# EAGLE schematic GBA_Modular_Matrix (EAGLE 6.6.0)
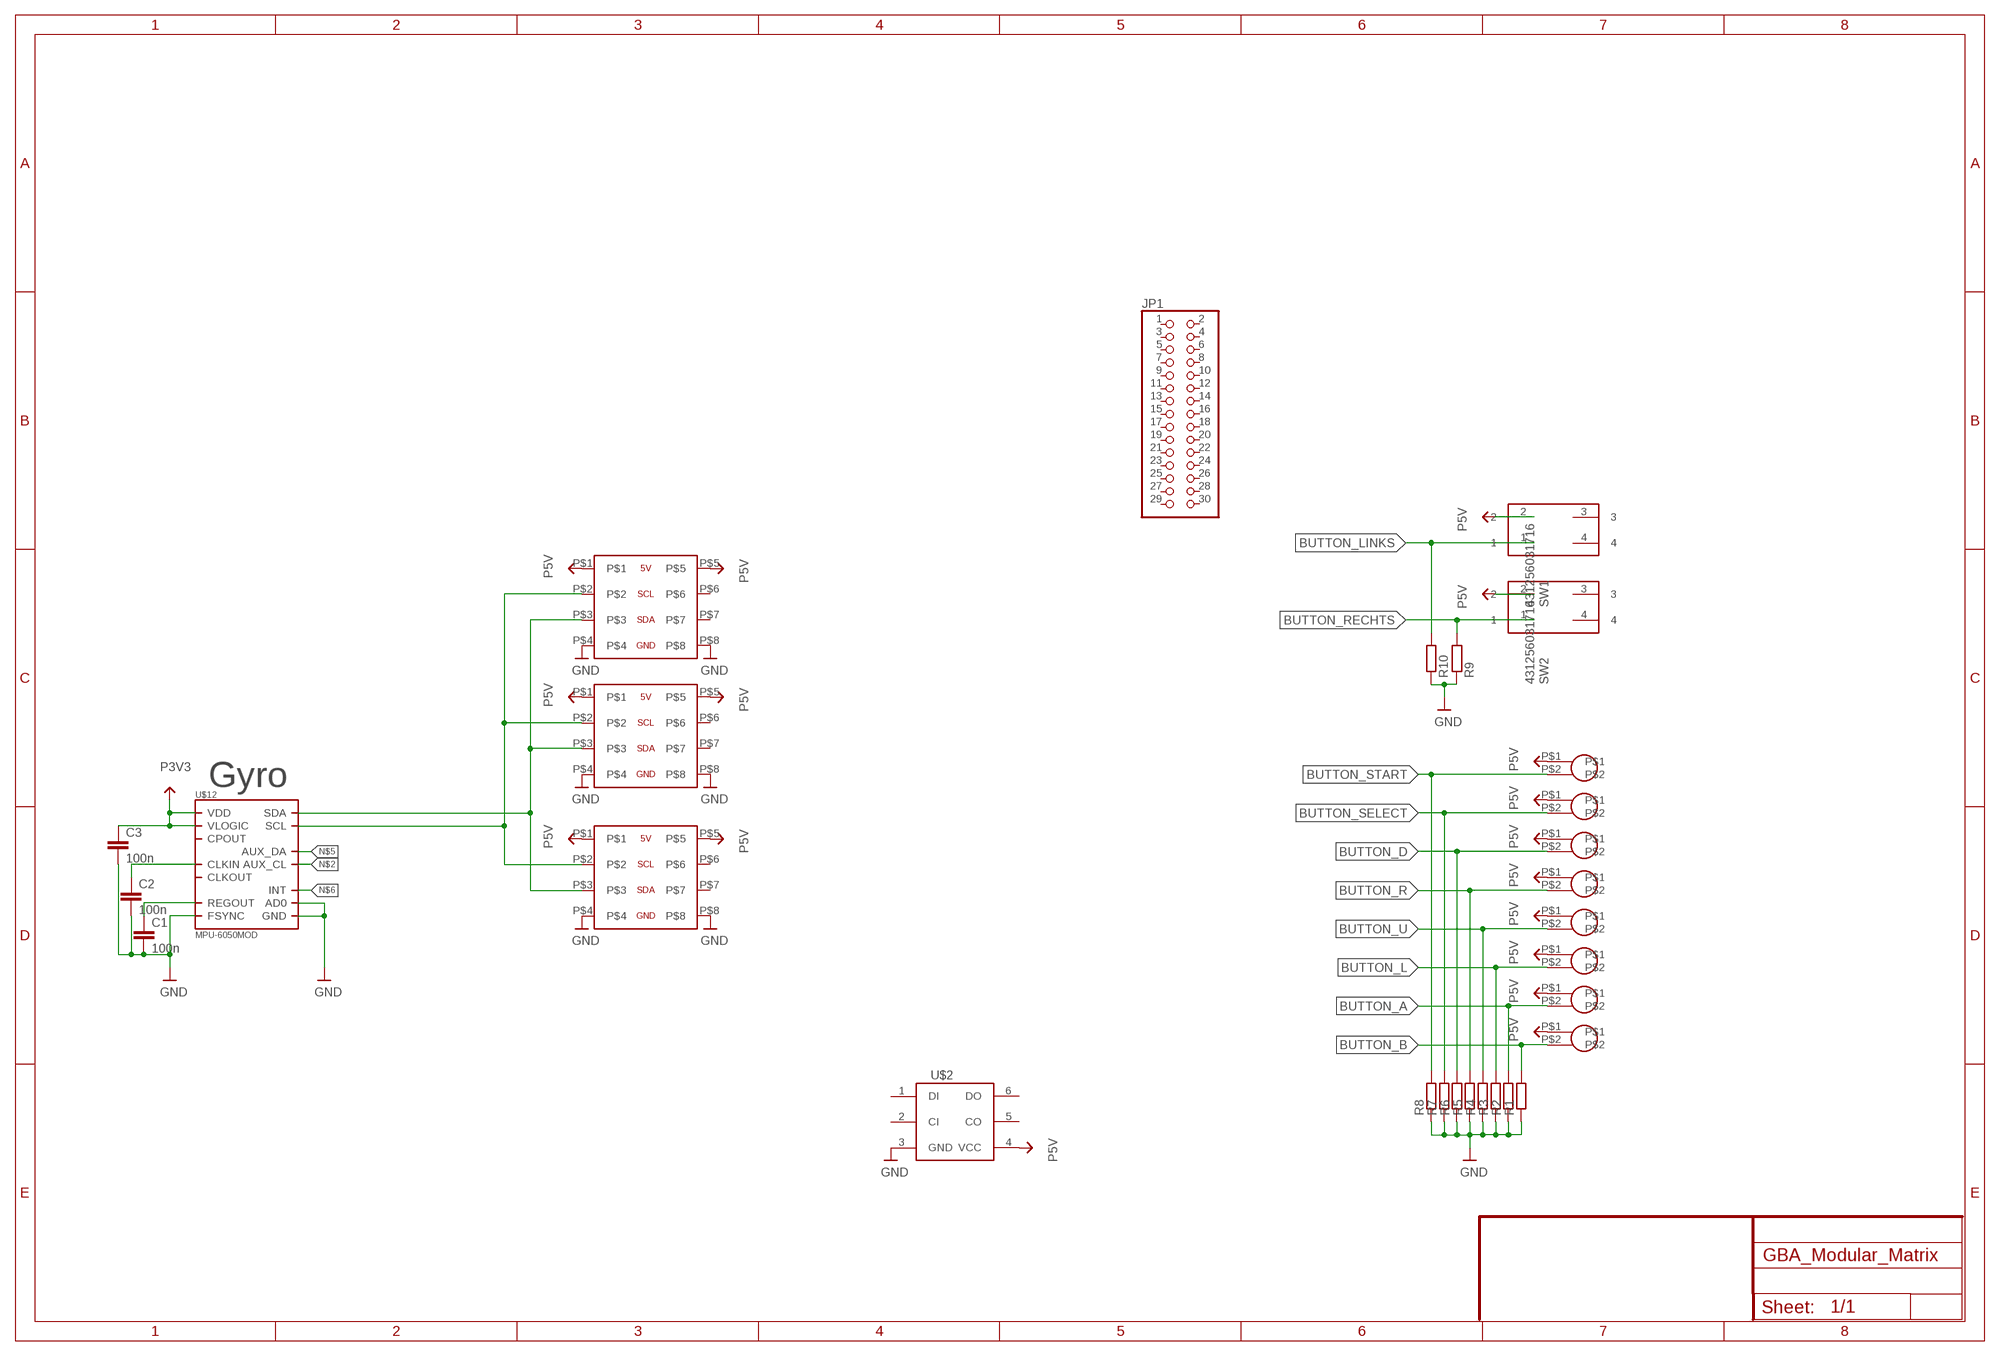
[diagram p0: schematic, sheet 1]

## Parts
C1  100n  C-EUC0603  [C0603]
C2  100n  C-EUC0603  [C0603]
C3  100n  C-EUC0603  [C0603]
JP1  PINHD-2X15  [2X15]
R1  R-EU_R0805  [R0805]
R2  R-EU_R0805  [R0805]
R3  R-EU_R0805  [R0805]
R4  R-EU_R0805  [R0805]
R5  R-EU_R0805  [R0805]
R6  R-EU_R0805  [R0805]
R7  R-EU_R0805  [R0805]
R8  R-EU_R0805  [R0805]
R9  R-EU_R0805  [R0805]
R10  R-EU_R0805  [R0805]
SW1  431256031716  [431256031716]
SW2  431256031716  [431256031716]
U$2  APA102  [LED5050]
U$4  GBA_BUTTONAB  [GBA_AB]
U$5  GBA_BUTTONAB  [GBA_AB]
U$6  GBA_BUTTONDIREKTION  [GBA_DIREKTION]
U$7  GBA_BUTTONDIREKTION  [GBA_DIREKTION]
U$8  GBA_BUTTONDIREKTION  [GBA_DIREKTION]
U$9  GBA_BUTTONDIREKTION  [GBA_DIREKTION]
U$10  GBA_BUTTONSTART  [GBA_START]
U$11  GBA_BUTTONSTART  [GBA_START]
U$12  MPU-6050MOD  [QFN.24.4X4.MOD]
U$18  DEBAUER_18X6MATRIX  [DEBAUER_16X8MATRIX]
U$19  DEBAUER_18X6MATRIX  [DEBAUER_16X8MATRIX]
U$20  DEBAUER_18X6MATRIX  [DEBAUER_16X8MATRIX]

## Nets
BUTTON_A: R2.2 U$4.P$2
BUTTON_B: R1.2 U$5.P$2
BUTTON_D: R6.2 U$6.P$2
BUTTON_L: R3.2 U$9.P$2
BUTTON_LINKS: R10.2 SW1.1
BUTTON_R: R5.2 U$7.P$2
BUTTON_RECHTS: R9.2 SW2.1
BUTTON_SELECT: R7.2 U$11.P$2
BUTTON_START: R8.2 U$10.P$2
BUTTON_U: R4.2 U$8.P$2
GND: C1.2 C2.2 C3.2 R1.1 R2.1 R3.1 R4.1 R5.1 R6.1 R7.1 R8.1 R9.1 R10.1 U$2.3(GND) U$12.9(AD0) U$12.11(FSYNC) U$12.18(GND) U$18.P$4 U$18.P$8 U$19.P$4 U$19.P$8 U$20.P$4 U$20.P$8
N$1: C2.1 U$12.1(CLKIN)
N$2: U$12.7(AUX_CL)
N$3: C1.1 U$12.10(REGOUT)
N$4: U$12.23(SCL) U$18.P$2 U$19.P$2 U$20.P$2
N$5: U$12.6(AUX_DA)
N$6: U$12.12(INT)
N$7: U$12.24(SDA) U$18.P$3 U$19.P$3 U$20.P$3
P3V3: C3.1 U$12.8(VLOGIC) U$12.13(VDD)
P5V: SW1.2 SW2.2 U$2.4(VCC) U$4.P$1 U$5.P$1 U$6.P$1 U$7.P$1 U$8.P$1 U$9.P$1 U$10.P$1 U$11.P$1 U$18.P$1 U$18.P$5 U$19.P$1 U$19.P$5 U$20.P$1 U$20.P$5
Unconnected: JP1.1 JP1.2 JP1.3 JP1.4 JP1.5 JP1.6 JP1.7 JP1.8 JP1.9 JP1.10 JP1.11 JP1.12 JP1.13 JP1.14 JP1.15 JP1.16 JP1.17 JP1.18 JP1.19 JP1.20 JP1.21 JP1.22 JP1.23 JP1.24 JP1.25 JP1.26 JP1.27 JP1.28 JP1.29 JP1.30 SW1.3 SW1.4 SW2.3 SW2.4 U$2.1(DI) U$2.2(CI) U$2.5(CO) U$2.6(DO) U$12.20(CPOUT) U$12.22(CLKOUT) U$18.P$6 U$18.P$7 U$19.P$6 U$19.P$7 U$20.P$6 U$20.P$7

## Notes on the sheet
- Gyro

## Library data of the parts
C1-C3 = debauer_passiv:C-EU: CAPACITOR, European symbol
JP1 = pinhead:PINHD-2X15: PIN HEADER
R1-R10 = debauer_passiv:R-EU_: RESISTOR, European symbol
SW1 SW2 = Wuerth_Elektronik_Switch:431256031716: WS-TST, 6*6mm right angle Tact switch,THT, height 3.15mm, 4 pins, black actuator, 160gf
U$2 = debauer_led:APA102
U$4-U$11 = debauer_button:GBA_BUTTON
U$12 = debauer_ics:MPU-6050
U$18-U$20 = debauer_modules:DEBAUER_18X6MATRIX

## Net classes
2 gnd: width 0.254 mm, drill 0.254 mm, clearance 0.178 mm
3 usbvcc: width 0.203 mm, drill 0.406 mm, clearance 0.178 mm
4 USBpair: width 0.254 mm, drill 0.406 mm, clearance 0.508 mm